# Altium schematic sheet LCDTFT_FPC40P_RGB_RTP.SchDoc
size A3
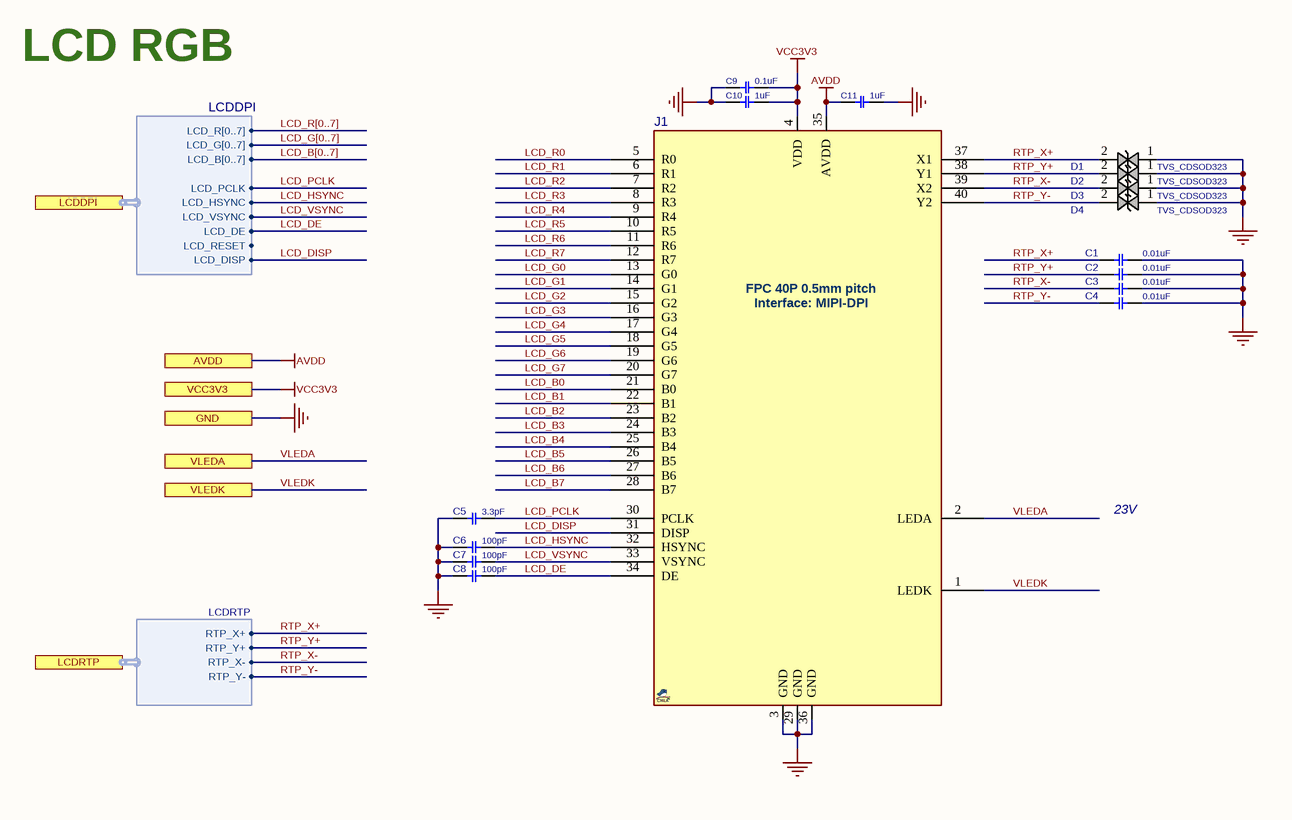
[diagram p0: LCDTFT_FPC40P_RGB_RTP.SchDoc]

## Parts
C1  0.01uF  [C0402]
C2  0.01uF  [C0402]
C3  0.01uF  [C0402]
C4  0.01uF  [C0402]
C5  3.3pF  [C0402]
C6  100pF  [C0402]
C7  100pF  [C0402]
C8  100pF  [C0402]
C9  0.1uF  [C0402]
C10  1uF  [C0402]
C11  1uF  [C0402]
D1  TVS_CDSOD323  [D0805]
D2  TVS_CDSOD323  [D0805]
D3  TVS_CDSOD323  [D0805]
D4  TVS_CDSOD323  [D0805]
J1  FPC_40_0.5mm  [FPC50_40]  (value not drawn)

## Ports
AVDD, GND, LCDDPI (harness LCDDPI), LCDRTP (harness LCDRTP), VCC3V3, VLEDA, VLEDK

## Harnesses
LCDDPI: LCD_PCLK, LCD_HSYNC, LCD_VSYNC, LCD_DE, LCD_R[0..7], LCD_G[0..7], LCD_B[0..7], LCD_RESET, LCD_DISP
LCDRTP: RTP_X+, RTP_Y+, RTP_X-, RTP_Y-

## Nets
AVDD: C11.2 J1.35(AVDD) ; port AVDD
GND: C1.1 C2.1 C3.1 C4.1 C5.2 C6.2 C7.2 C8.2 C9.2 C10.2 C11.1 D1.1 D2.1 D3.1 D4.1 J1.3(GND) J1.29(GND) J1.36(GND) ; port GND
VCC3V3: C9.1 C10.1 J1.4(VDD) ; port VCC3V3
LCD_B0: J1.21(B0)
LCD_B1: J1.22(B1)
LCD_B2: J1.23(B2)
LCD_B3: J1.24(B3)
LCD_B4: J1.25(B4)
LCD_B5: J1.26(B5)
LCD_B6: J1.27(B6)
LCD_B7: J1.28(B7)
LCD_DE: C8.1 J1.34(DE) ; port LCDDPI.LCD_DE
LCD_DISP: J1.31(DISP) ; port LCDDPI.LCD_DISP
LCD_G0: J1.13(G0)
LCD_G1: J1.14(G1)
LCD_G2: J1.15(G2)
LCD_G3: J1.16(G3)
LCD_G4: J1.17(G4)
LCD_G5: J1.18(G5)
LCD_G6: J1.19(G6)
LCD_G7: J1.20(G7)
LCD_HSYNC: C6.1 J1.32(HSYNC) ; port LCDDPI.LCD_HSYNC
LCD_PCLK: C5.1 J1.30(PCLK) ; port LCDDPI.LCD_PCLK
LCD_R0: J1.5(R0)
LCD_R1: J1.6(R1)
LCD_R2: J1.7(R2)
LCD_R3: J1.8(R3)
LCD_R4: J1.9(R4)
LCD_R5: J1.10(R5)
LCD_R6: J1.11(R6)
LCD_R7: J1.12(R7)
LCD_VSYNC: C7.1 J1.33(VSYNC) ; port LCDDPI.LCD_VSYNC
RTP_X+: C1.2 D1.2 J1.37(X1) ; port LCDRTP.RTP_X+
RTP_X-: C3.2 D3.2 J1.39(X2) ; port LCDRTP.RTP_X-
RTP_Y+: C2.2 D2.2 J1.38(Y1) ; port LCDRTP.RTP_Y+
RTP_Y-: C4.2 D4.2 J1.40(Y2) ; port LCDRTP.RTP_Y-
VLEDA: J1.2(LEDA) ; port VLEDA
VLEDK: J1.1(LEDK) ; port VLEDK

## Buses and harness runs
bus LCD_B[0..7]
bus LCD_G[0..7]
bus LCD_R[0..7]

## Notes on the sheet
- LCD RGB
- 23V
- (in symbol LCDTFT_DPI_FPC40P) FPC 40P 0.5mm pitch; Interface: MIPI-DPI

## Library data of the parts
C1-C8 = CAP_SMD_MLCC: CAP, MLCC; PARAM: X5R, 10%; PARAM2: 50v; PRICE: 50,000:	$0.006; MANF_P#: -; MANF: -; ASSEMBLY: ASSEMBLY
  C1-C4: VALUE: 0.01uF
  C5: VALUE: 3.3pF
  C6-C8: VALUE: 100pF
C9 = CAP_SMD_MLCC: CAP, MLCC; PARAM: X7R, 10%, -55~125oC; MANF_P#: GRM155R71H104KE14D; MANF: Murata; PARAM2: 50v; PRICE: 100: 0.018$; ASSEMBLY: ASSEMBLY; VALUE: 0.1uF
C10 C11 = CAP_SMD_MLCC: CAP, MLCC; PARAM: X5R, 10%; MANF_P#: CL05A105KO5NNND; MANF: Samsung; PARAM2: 16v; PRICE: 50,000:	$0.006; ASSEMBLY: ASSEMBLY; VALUE: 1uF
D1-D4 = TVS_CDSOD323: TVS, ESD PROTECT, Bidirectional; MANF_P#: CDSOD323-T12C; MANF: Bourns; PARAM2: 13.3VB, 12VR; PRICE: 0.7$; VALUE: TVS_CDSOD323
J1 = LCDTFT_DPI_FPC40P: LCD TFT Color, FPC40P, RGB; MANF: -; MANF_P#: -; PARAM: -; VALUE: FPC_40_0.5mm